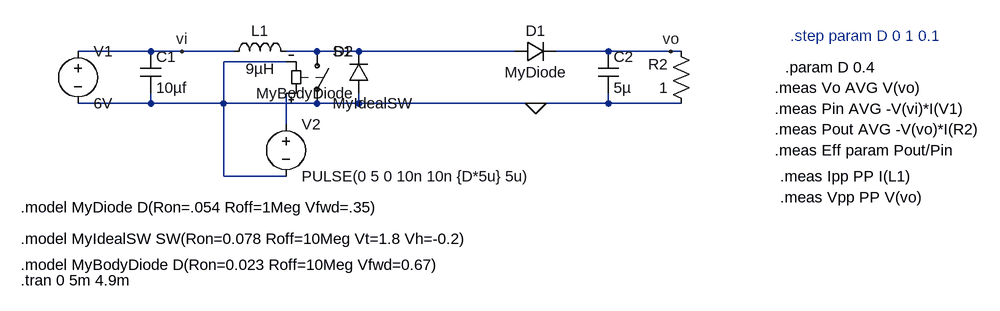
[diagram p0: schematic boost.asc]
boost.asc, the LTspice schematic file:
Version 4.1
SHEET 1 1432 680
WIRE 128 112 16 112
WIRE 176 112 128 112
WIRE 256 112 176 112
WIRE 384 112 336 112
WIRE 448 112 384 112
WIRE 688 112 448 112
WIRE 832 112 752 112
WIRE 928 112 832 112
WIRE 944 112 928 112
WIRE 336 128 240 128
WIRE 128 192 128 176
WIRE 128 192 16 192
WIRE 240 192 240 128
WIRE 240 192 128 192
WIRE 384 192 240 192
WIRE 448 192 448 176
WIRE 448 192 384 192
WIRE 720 192 448 192
WIRE 832 192 832 176
WIRE 832 192 720 192
WIRE 944 192 832 192
WIRE 336 224 336 176
WIRE 240 304 240 192
WIRE 336 304 240 304
FLAG 720 192 0
FLAG 928 112 vo
FLAG 176 112 vi
SYMBOL voltage 16 96 R0
WINDOW 123 0 0 Left 0
WINDOW 39 0 0 Left 0
SYMATTR InstName V1
SYMATTR Value 6V
SYMBOL cap 112 112 R0
SYMATTR InstName C1
SYMATTR Value 10µf
SYMBOL res 960 208 R180
WINDOW 0 36 76 Left 2
WINDOW 3 36 40 Left 2
SYMATTR InstName R2
SYMATTR Value 1
SYMBOL cap 816 112 R0
SYMATTR InstName C2
SYMATTR Value 5µ
SYMBOL diode 688 128 R270
WINDOW 0 32 32 VTop 2
WINDOW 3 0 32 VBottom 2
SYMATTR InstName D1
SYMATTR Value MyDiode
SYMBOL sw 384 96 R0
SYMATTR InstName S1
SYMATTR Value MyIdealSW
SYMBOL voltage 336 208 R0
WINDOW 123 0 0 Left 0
WINDOW 39 0 0 Left 0
SYMATTR InstName V2
SYMATTR Value PULSE(0 5 0 10n 10n {D*5u} 5u)
SYMBOL ind 240 128 R270
WINDOW 0 32 56 VTop 2
WINDOW 3 5 56 VBottom 2
SYMATTR InstName L1
SYMATTR Value 9µH
SYMBOL diode 464 176 R180
WINDOW 0 24 64 Left 2
WINDOW 3 24 0 Left 2
SYMATTR InstName D2
SYMATTR Value MyBodyDiode
TEXT -72 352 Left 2 !.model MyDiode D(Ron=.054 Roff=1Meg Vfwd=.35)
TEXT -72 440 Left 2 !.model MyBodyDiode D(Ron=0.023 Roff=10Meg Vfwd=0.67)
TEXT -72 400 Left 2 !.model MyIdealSW SW(Ron=0.078 Roff=10Meg Vt=1.8 Vh=-0.2)
TEXT -72 464 Left 2 !.tran 0 5m 4.9m
TEXT 1088 168 Left 2 !.meas Vo AVG V(vo)
TEXT 1088 200 Left 2 !.meas Pin AVG -V(vi)*I(V1)
TEXT 1088 232 Left 2 !.meas Pout AVG -V(vo)*I(R2)
TEXT 1088 264 Left 2 !.meas Eff param Pout/Pin
TEXT 1112 88 Left 2 ;.step param D 0 1 0.1
TEXT 1104 136 Left 2 !.param D 0.4
TEXT 1096 304 Left 2 !.meas Ipp PP I(L1)
TEXT 1096 336 Left 2 !.meas Vpp PP V(vo)

The netlist it stands for:
* boost.asc
V1 vi 0 6V
C1 vi 0 10µf
R2 0 vo 1
C2 vo 0 5µ
D1 N001 vo MyDiode
S1 N001 0 N002 0 MyIdealSW
V2 N002 0 PULSE(0 5 0 10n 10n {D*5u} 5u)
L1 vi N001 9µH
D2 0 N001 MyBodyDiode
.model D D
.lib standard.dio
.model MyDiode D(Ron=.054 Roff=1Meg Vfwd=.35)
.model MyBodyDiode D(Ron=0.023 Roff=10Meg Vfwd=0.67)
.model MyIdealSW SW(Ron=0.078 Roff=10Meg Vt=1.8 Vh=-0.2)
.tran 0 5m 4.9m
.meas Vo AVG V(vo)
.meas Pin AVG -V(vi)*I(V1)
.meas Pout AVG -V(vo)*I(R2)
.meas Eff param Pout/Pin
* .step param D 0 1 0.1
.param D 0.4
.meas Ipp PP I(L1)
.meas Vpp PP V(vo)
.backanno
.end